# Altium schematic sheet pulse_generator_pen.SchDoc
size B; SheetNumber: 1; SheetTotal: 1
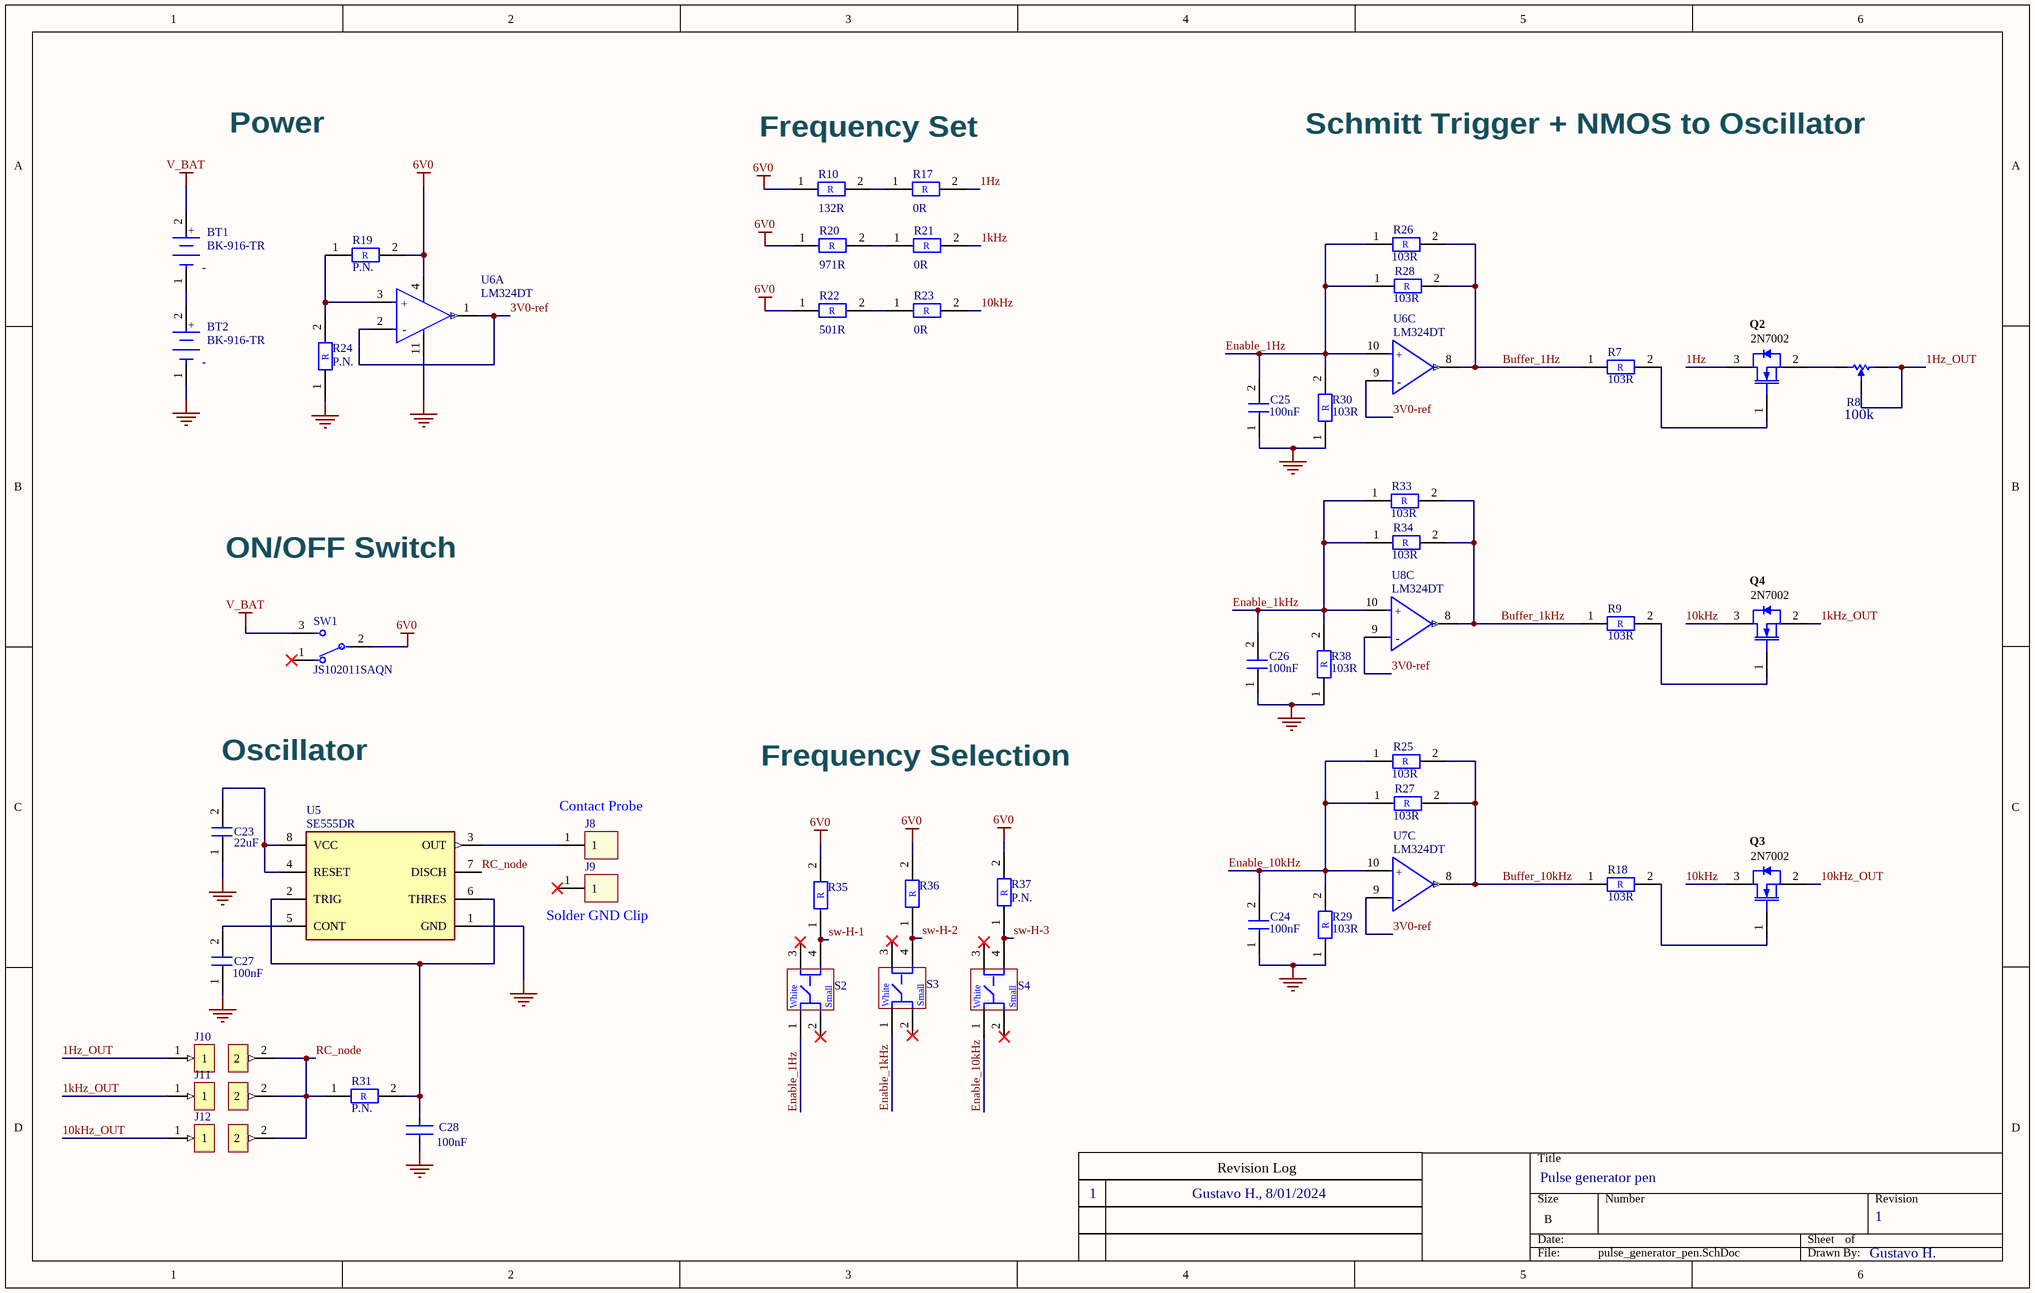
[diagram p0: pulse_generator_pen.SchDoc]

## Parts
BT1  BK-916-TR  [FP-BK-916-TR-MFG]
BT2  BK-916-TR  [FP-BK-916-TR-MFG]
C23  Capacitance: 22uF  [0805_R]  (hidden comment: P.N.)
C24  Capacitance: 100nF  [0805_R]  (hidden comment: P.N.)
C25  Capacitance: 100nF  [0805_R]  (hidden comment: P.N.)
C26  Capacitance: 100nF  [0805_R]  (hidden comment: P.N.)
C27  Capacitance: 100nF  [0805_R]  (hidden comment: P.N.)
C28  Capacitance: 100nF  [FP-CL21-IPC_A]  (hidden comment: CL21B104KBCNNNC)
J8  HEADER_1POS_MALE  [HEADER_1POS_MALE_VERT_2.54MM]  (value not drawn)
J9  HEADER_1POS_MALE  [HEADER_1POS_MALE_VERT_2.54MM]  (value not drawn)
J10  JUMPER_RECT  (value not drawn)
J11  JUMPER_RECT  (value not drawn)
J12  JUMPER_RECT  (value not drawn)
Q2  2N7002  [INF-PG-SOT23_M]
Q3  2N7002  [INF-PG-SOT23_M]
Q4  2N7002  [INF-PG-SOT23_M]
R7  Resistance: 103R  [0805_R]  (hidden comment: P.N.)
R8  3296W-1-102LF  [BOUR-3296W-1-3]  (value not drawn)
R9  Resistance: 103R  [0805_R]  (hidden comment: P.N.)
R10  Resistance: 132R  [0805_R]  (hidden comment: P.N.)
R17  Resistance: 0R  [0805_R]  (hidden comment: P.N.)
R18  Resistance: 103R  [0805_R]  (hidden comment: P.N.)
R19  P.N.  [0805_R]
R20  Resistance: 971R  [0805_R]  (hidden comment: P.N.)
R21  Resistance: 0R  [0805_R]  (hidden comment: P.N.)
R22  Resistance: 501R  [0805_R]  (hidden comment: P.N.)
R23  Resistance: 0R  [0805_R]  (hidden comment: P.N.)
R24  P.N.  [0805_R]
R25  Resistance: 103R  [0805_R]  (hidden comment: P.N.)
R26  Resistance: 103R  [0805_R]  (hidden comment: P.N.)
R27  Resistance: 103R  [0805_R]  (hidden comment: P.N.)
R28  Resistance: 103R  [0805_R]  (hidden comment: P.N.)
R29  Resistance: 103R  [0805_R]  (hidden comment: P.N.)
R30  Resistance: 103R  [0805_R]  (hidden comment: P.N.)
R31  P.N.  [0805_R]
R33  Resistance: 103R  [0805_R]  (hidden comment: P.N.)
R34  Resistance: 103R  [0805_R]  (hidden comment: P.N.)
R35  P.N.  [0805_R]  (value not drawn)
R36  P.N.  [0805_R]  (value not drawn)
R37  P.N.  [0805_R]
R38  Resistance: 103R  [0805_R]  (hidden comment: P.N.)
S2  TACT_SWITCH_SMD_5x3MM  [TACT_SWITCH_SMD_5x3MM]  (value not drawn)
S3  TACT_SWITCH_SMD_5x3MM  [TACT_SWITCH_SMD_5x3MM]  (value not drawn)
S4  TACT_SWITCH_SMD_5x3MM  [TACT_SWITCH_SMD_5x3MM]  (value not drawn)
SW1  JS102011SAQN  [FP-JS102011SAQN-MFG]
U5  SE555DR  [FP-D0008A-MFG]
U6  LM324DT  [FP-SO-14-MFG]  (parts A,C of 4)
U7  LM324DT  [FP-SO-14-MFG]  (part C of 4)
U8  LM324DT  [FP-SO-14-MFG]  (part C of 4)

## Nets
6V0: R10.1 R19.2 R20.1 R22.1 R35.2 R36.2 R37.2 SW1.2(C) U6.4(VCC+)
GND: BT2.1(C) C23.1 C24.1 C25.1 C26.1 C27.1 C28.1 R24.1 R29.1 R30.1 R38.1 U5.1(GND) U6.11(VCC-)
V_BAT: BT1.2(A) SW1.3
1Hz: Q2.3(DRAIN) R17.2
1Hz_OUT: J10.1 R8.2(B) R8.3(TAP)
1kHz: R21.2
1kHz_OUT: J11.1 Q4.2(SOURCE)
3V0-ref: U6.1(Output_1) U6.2(Inverting_Input_1) U6.9(Inverting_Input_3) U7.9(Inverting_Input_3) U8.9(Inverting_Input_3)
10kHz: Q3.3(DRAIN) Q4.3(DRAIN) R23.2
10kHz_OUT: J12.1 Q3.2(SOURCE)
Buffer_1Hz: R7.1 R26.2 R28.2 U6.8(Output_3)
Buffer_1kHz: R9.1 R33.2 R34.2 U8.8(Output_3)
Buffer_10kHz: R18.1 R25.2 R27.2 U7.8(Output_3)
Enable_1Hz: C25.2 R26.1 R28.1 R30.2 S2.1 U6.10(Non-Inverting_Input_3)
Enable_1kHz: C26.2 R33.1 R34.1 R38.2 S3.1 U8.10(Non-Inverting_Input_3)
Enable_10kHz: C24.2 R25.1 R27.1 R29.2 S4.1 U7.10(Non-Inverting_Input_3)
RC_node: J10.2 J11.2 J12.2 R31.1 U5.7(DISCH)
sw-H-1: R35.1 S2.4
sw-H-2: R36.1 S3.4
sw-H-3: R37.1 S4.4
NetBT1_1: BT1.1(C) BT2.2(A)
NetC23_2: C23.2 U5.4(RESET) U5.8(VCC)
NetC27_2: C27.2 U5.5(CONT)
NetC28_2: C28.2 R31.2 U5.2(TRIG) U5.6(THRES)
NetJ8_1: J8.1 U5.3(OUT)
NetQ2_1: Q2.1(GATE) R7.2
NetQ2_2: Q2.2(SOURCE) R8.1(A)
NetQ3_1: Q3.1(GATE) R18.2
NetQ4_1: Q4.1(GATE) R9.2
NetR10_2: R10.2 R17.1
NetR19_1: R19.1 R24.2 U6.3(Non-Inverting_Input_1)
NetR20_2: R20.2 R21.1
NetR22_2: R22.2 R23.1

Not connected (* = marked no-connect by the designer): J9 1*; S2 2* 3*; S3 2* 3*; S4 2* 3*; SW1 1*

## Notes on the sheet
- Power
- Frequency Set
- Schmitt Trigger + NMOS to Oscillator
- (near R8) 100k
- ON/OFF Switch
- Oscillator
- Frequency Selection
- (near J8) Contact Probe
- (near J9) Solder GND Clip
- Pulse generator pen
- 1
- Gustavo H., 8/01/2024
- Gustavo H.
- Revision Log
- (in symbol 0805_R) R
- (in symbol CMP-12131-000005-1, part A) +; -
- (in symbol CMP-12131-000005-1, part C) +; -
- (in symbol CMP-136216-000004-1) +; -
- (in symbol TACT_SWITCH_SMD_5x3MM) White; Small

## Library data of the parts
BT1 BT2 = CMP-136216-000004-1: BATTERY RETAINER COIN 12MM SMD; Number of Cells: 1; Termination: SMD/SMT; Mount: Surface Mount
C23-C27 = 0805_C: Generic 0805 Capacitor; Voltage Rating: 10V; Dielectric: XR7
C28 = CMP-2000-05017-2: CL21 Series 0805 100nF 50V ±10% Tolerance X7R Multilayer Ceramic Chip Capacitor; Depth: 1.25mm; Height: 0.85mm; Width: 0.049inch; Tolerance: 10%; Case Code (Metric): 2012; Case Code (Imperial): 0805; Material: Ceramic; Thickness: 0.037inch; Min Operating Temperature: -55°C; Contact Plating: Tin; Length: 2mm; Mount: Surface Mount; Voltage Rating (DC): 50V; Lead Free: Lead Free; Dielectric: X7R; Radiation Hardening: No; Voltage Rating: 50V; Case/Package: 0805; Packaging: Tape and Reel; Max Operating Temperature: 125°C; Voltage: 50V
J10-J12 = JUMPER_RECT: Small rectangular jumper
Q2-Q4 = CMP-1149-00026-1: N-Channel OptiMOS Small-Signal-Transistor, 60 V VDS, 0.3 A ID, -55 to 150 degC, PG-SOT23, Reel, Green; Manufacturer: Infineon; RDS (on) (max) (@4.5V): 4,000 mOhm; VDS (max): 60 V; IDpuls (max): 1.2Â A; QG: 0.4Â nC; RDS (on) (max): 3,000 mOhm; RthJA (max): 250 K/W; ID (max): 0.3Â A; VGS(th) (max): 2.5Â V; VGS(th) (min): 1.5Â V; Green: TRUE; Ptot (max): 0.5Â W; PackageDescription: 3-Pin Small Outline Transistor Package, 2.9 x 1.3 mm Body, 0.95 mm Pitch; Halogen-free: TRUE; ComponentLink2Description: Datasheet; ComponentLink1URL: http://www.infineon.com/; Packing: Reel; DatasheetVersion: Rev. 2.4; PartNumber: 2N7002; PackageReference: PG-SOT23; PackageVersion: Apr-08; ComponentLink3URL: http://www.infineon.com/dgdl/SOT23-Package_Overview.pdf?folderId=db3a30431936bc4b0119532290053c66&fileId=db3a30431936bc4b0119533468123c85; ComponentLink1Description: Manufacturer URL; Mounting Technology: Surface Mount; ComponentLink3Description: Package Specification; ComponentLink2URL: http://www.infineon.com/dgdl/2N7002_Rev2.4.pdf?folderId=db3a3043156fd573011622e10b5c1f67&fileId=db3a304319bc939a0119c2a9461e79e6
R7 R9 R10 R17 R18 R20-R23 R25-R30 R33 R34 R38 = 0805_R: Generic 0805 Resistor; Power Rating: 0.5W
R8 = CMP-1747-00002-1: Square Trimpot(R) Trimming Potentiometer, 1000 Ohm, -55 to 125 degC, 3-Pin THD, RoHS, Tube; Case\Package: 0603; Tolerance: 1%; Power Rating: 100 mW; Voltage Rating: 75 V; Resistance: 4.7 kohm; ComponentLink2URL: http://www.bourns.com/docs/Product-Datasheets/3296.pdf; Packaging: Tape and Reel; REACH SVHC: Yes; ComponentLink1URL: http://www.bourns.com/; Case Code (Metric): 1608; Width: 0.8 mm; ComponentLink1Description: Manufacturer URL; DatasheetVersion: May-16; Max Operating Temperature: 155 degC; PackageReference: 3296W-1-3; PackageDescription: 3-Pin Through Hole Device, Body 9.53 x 4.83 mm, Pitch 2.54 mm; Weight: 7.1E-05 oz; ComponentLink2Description: Datasheet; RoHSCompliant: true; Min Operating Temperature: -55 degC; Radiation Hardening: No; Case Code (Imperial): 0603; Length: 1.6 mm; Package Quantity: 5000; Pins: 2; Mount: Surface Mount; Height: 0.45 mm
R19 R24 R31 R35-R37 = 0805_R: Generic 0805 Resistor; Resistance: 103R; Power Rating: 0.5W
SW1 = CMP-2000-06501-2: SWITCH SLIDE SPDT 300MA 6V; Switch Function: On-On; Illumination Type: Non-Illuminated; Switch Travel: 2mm; Contact Resistance: 70mR; Actuator Material: Nylon; Electrical Life: 5000Cycles; Actuator Type: Standard; Max Operating Temperature: 85°C; Housing Material: Nylon; Radiation Hardening: No; Max Voltage Rating (DC): 6V; Package Quantity: 1; Case/Package: 100; Actuator Length: 2mm; Min Operating Temperature: -40°C; Contact Current Rating: 300mA; REACH SVHC: No SVHC; Throw Configuration: SPDT; Packaging: Tape and Reel; Contact Material: Copper Alloy; Max Current Rating: 300mA; Current Rating: 300mA; Mount: Surface Mount; Lead Free: Lead Free; Termination: Gull Wing; Voltage Rating (DC): 6V; Length: 9mm; Orientation: Right Angle; Contact Plating: Silver
U5 = CMP-04858-000018-1: IC OSC SGL TIMER 100KHZ 8-SOIC; Nominal Supply Current: 4mA; Min Supply Voltage: 4.5V; Max Supply Voltage: 18V; High Level Output Current: -200mA; Quiescent Current: 12mA; Operating Supply Current: 10mA; Number of Timers/Counters: 1; Low Level Output Current: 200mA; Weight: 0.002677oz; Frequency: 100kHz; Lead Free: Lead Free; Supply Current: 4mA; RoHS Compliant: Yes; Package Quantity: 2500; Min Operating Temperature: -55°C; Series: -; Radiation Hardening: No; Contact Plating: Gold; Packaging: Tape and Reel; Case/Package: SOIC; Number of Pins: 8; Mount: Surface Mount; Max Operating Temperature: 125°C; REACH SVHC: No SVHC
U6-U8 = CMP-12131-000005-1: IC OPAMP GP 4 CIRCUIT 14SO; Manufacturer: STMicroelectronics; Voltage Gain: 100dB; Standoff Height: 0.1mm; Bandwidth: 1.3MHz; Max Junction Temp: +150°C; Min Supply Voltage: 3V; Max Dual Supply Voltage: 15V; Min Dual Supply Voltage: 1.5V; Number Of Channels: 4; Nominal Supply Current: 0.7-1.5mA; Output Current Per Channel: 20-50mA; Max Supply Voltage: 30V; Input Offset Voltage: 2mV; Input Bias Current: 0.02uA; Device Class L1: Integrated Circuits (ICs); Device Class L3: Amplifiers - Op Amps; Temperature Range Low: 0°C; Package: SO-14; Temperature Range High: +70°C; Digikey Description: IC OPAMP GP 4 CIRCUIT 14SO; Device Class L2: Linear ICs; Footprint Url: https://www.st.com/content/ccc/resource/technical/document/datasheet/group3/10/8a/e6/12/f8/e8/49/ce/DM00366438/files/DM00366438.pdf/jcr:content/translations/en.DM00366438.pdf; Octopart: https://octopart.com/lm324dt-stmicroelectronics-39579146; ComponentLink2URL: https://www.st.com/content/ccc/resource/technical/document/datasheet/bd/fc/46/43/26/8f/40/7f/CD00001046.pdf/files/CD00001046.pdf/jcr:content/translations/en.CD00001046.pdf; ComponentLink2Description: Datasheet; Lead Free: Yes; Temperature: 0°C to +70°C; RoHS: TRUE; Gain Bandwidth: 1.3MHz; Manufacturer Part Number: LM324DT; Automotive: No; Category: IC; Height: 1.75mm; Mouser Description: LM324 Series 32 V 1.3 MHz Low Power Quad Operational Amplifier - SOIC-14